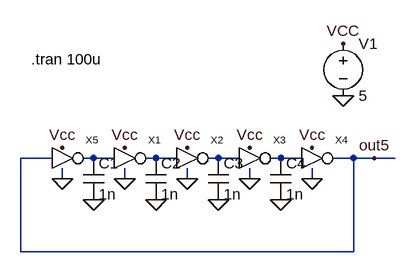
[diagram p0: schematic Perc-5-Ring.asc]
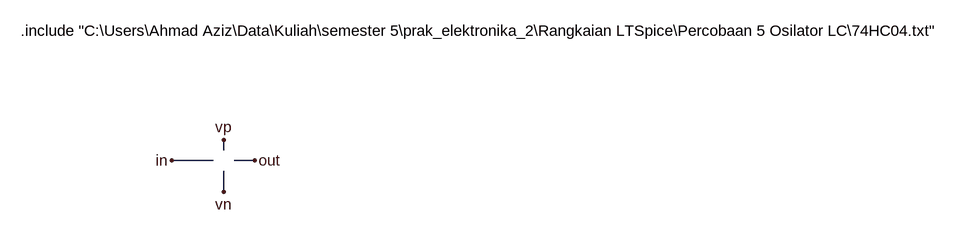
[diagram p1: sub-circuit 74hc04.asc]
Perc-5-Ring.asc, the LTspice schematic file:
Version 4
SHEET 1 880 680
WIRE 0 -176 -48 -176
WIRE 64 -176 48 -176
WIRE 96 -176 64 -176
WIRE 160 -176 144 -176
WIRE 192 -176 160 -176
WIRE 256 -176 240 -176
WIRE 288 -176 256 -176
WIRE 352 -176 336 -176
WIRE 384 -176 352 -176
WIRE 464 -176 432 -176
WIRE 496 -176 464 -176
WIRE 528 -176 496 -176
WIRE 16 -144 16 -160
WIRE 112 -144 112 -160
WIRE 208 -144 208 -160
WIRE 304 -144 304 -160
WIRE 400 -144 400 -160
WIRE -48 -32 -48 -176
WIRE 464 -32 464 -176
WIRE 464 -32 -48 -32
FLAG 448 -272 0
FLAG 448 -352 VCC
FLAG 16 -192 Vcc
FLAG 112 -192 Vcc
FLAG 208 -192 Vcc
FLAG 304 -192 Vcc
FLAG 400 -192 Vcc
FLAG 112 -144 0
FLAG 208 -144 0
FLAG 304 -144 0
FLAG 400 -144 0
FLAG 16 -144 0
FLAG 496 -176 out5
FLAG 64 -112 0
FLAG 160 -112 0
FLAG 256 -112 0
FLAG 352 -112 0
SYMBOL 74HC04 112 -176 R0
SYMATTR InstName X1
SYMBOL 74HC04 208 -176 R0
SYMATTR InstName X2
SYMBOL 74HC04 304 -176 R0
SYMATTR InstName X3
SYMBOL 74HC04 400 -176 R0
SYMATTR InstName X4
SYMBOL 74HC04 16 -176 R0
SYMATTR InstName X5
SYMBOL voltage 448 -368 R0
SYMATTR InstName V1
SYMATTR Value 5
SYMBOL cap 48 -176 R0
SYMATTR InstName C1
SYMATTR Value 1n
SYMBOL cap 144 -176 R0
SYMATTR InstName C2
SYMATTR Value 1n
SYMBOL cap 240 -176 R0
SYMATTR InstName C3
SYMATTR Value 1n
SYMBOL cap 336 -176 R0
SYMATTR InstName C4
SYMATTR Value 1n
TEXT -32 -328 Left 2 !.tran 100u

74hc04.asc, the sub-circuit schematic file:
Version 4
SHEET 1 1476 680
WIRE 208 160 208 144
WIRE 192 176 128 176
WIRE 256 176 224 176
WIRE 208 224 208 192
FLAG 128 176 in
FLAG 256 176 out
FLAG 208 144 vp
FLAG 208 224 vn
TEXT -104 -24 Left 2 !.include "C:\\Users\\Ahmad Aziz\\Data\\Kuliah\\semester 5\\prak_elektronika_2\\Rangkaian LTSpice\\Percobaan 5 Osilator LC\\74HC04.txt"

The netlist it stands for:
* Perc-5-Ring.asc
XX1 N001 N002 VCC 0 74hc04
XX2 N002 N003 VCC 0 74hc04
XX3 N003 N004 VCC 0 74hc04
XX4 N004 out5 VCC 0 74hc04
XX5 out5 N001 VCC 0 74hc04
V1 VCC 0 5
C1 N001 0 1n
C2 N002 0 1n
C3 N003 0 1n
C4 N004 0 1n

* block symbol definitions
.subckt 74hc04 in out vp vn
.include "C:\Users\Ahmad Aziz\Data\Kuliah\semester 5\prak_elektronika_2\Rangkaian LTSpice\Percobaan 5 Osilator LC\74HC04.txt"
.ends 74hc04

.tran 100u
.backanno
.end